# Altium schematic sheet 01_Top Level.SchDoc
size A3; SheetNumber: 1; SheetTotal: 14
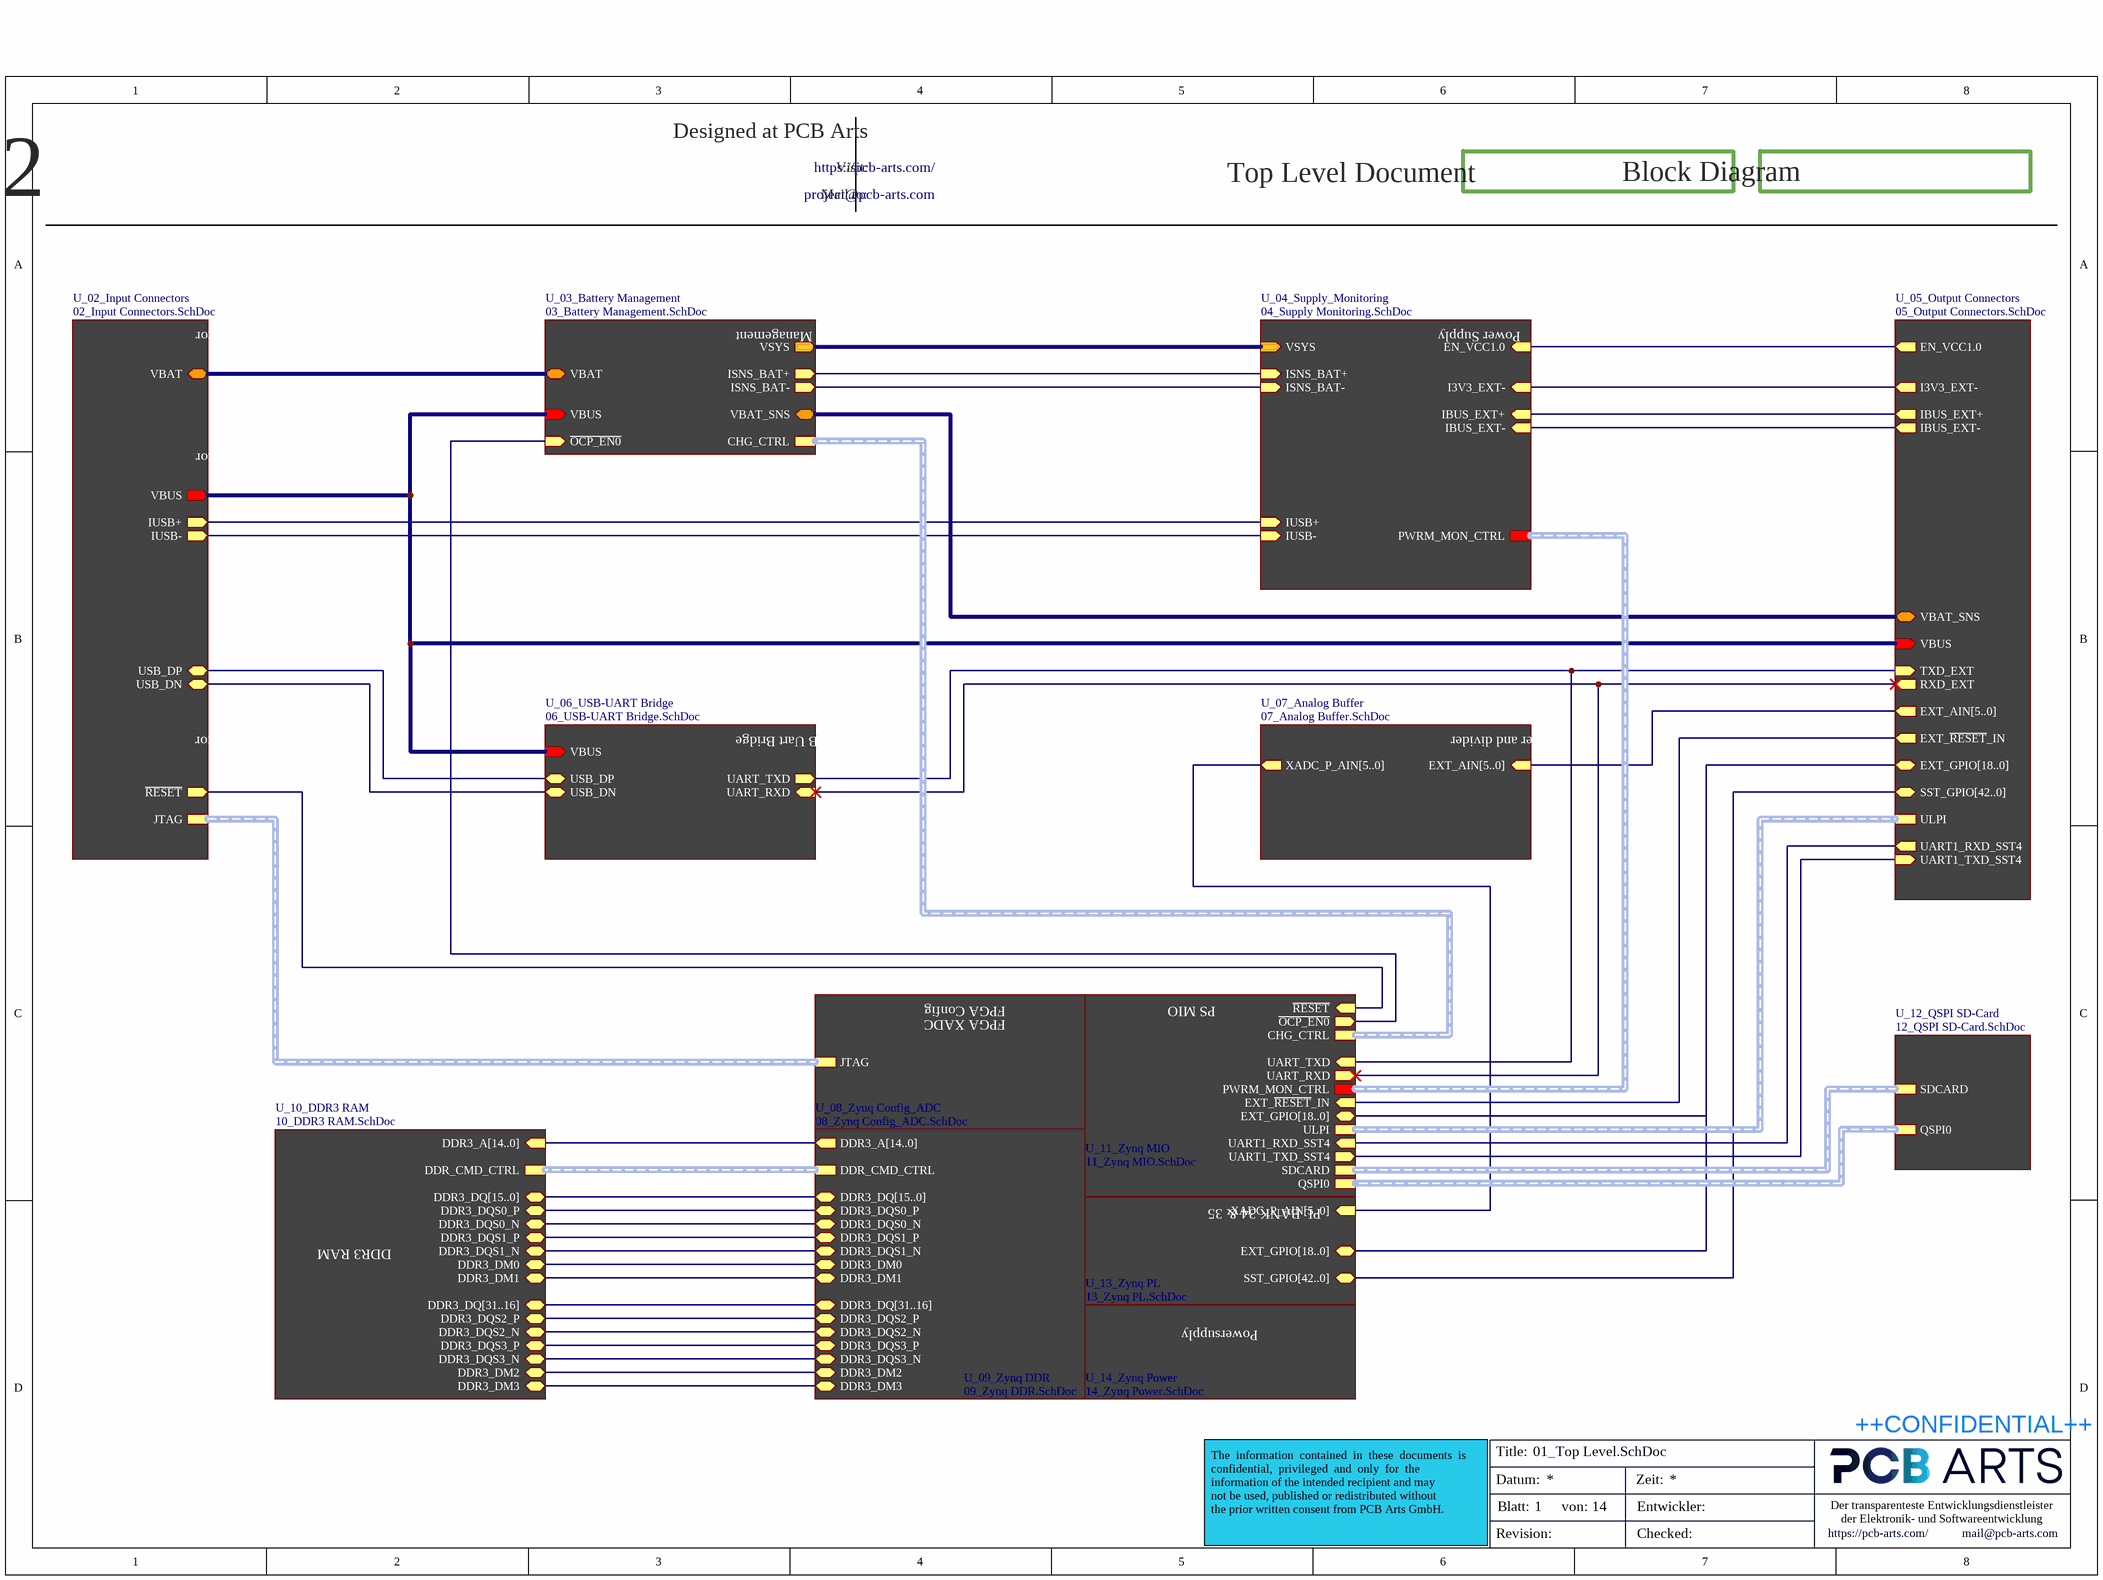
[diagram p0: 01_Top Level.SchDoc]

## Sub-sheets
U_02_Input Connectors = 02_Input Connectors.SchDoc: USB_DP (bidir), USB_DN (bidir), VBUS (out), VBAT (bidir), JTAG (harness JTAG), IUSB- (out), IUSB+ (out), ~{RESET} (out)
U_03_Battery Management = 03_Battery Management.SchDoc: VBUS (in), VBAT (bidir), VSYS (out), ISNS_BAT+ (out), ISNS_BAT- (out), VBAT_SNS (bidir), CHG_CTRL (harness CHG_CTRL), ~{OCP_EN0} (in)
U_04_Supply_Monitoring = 04_Supply Monitoring.SchDoc: EN_VCC1.0 (in), VSYS (in), PWRM_MON_CTRL (harness PWRM_MON_CTRL), ISNS_BAT+ (in), ISNS_BAT- (in), IBUS_EXT+ (in), IBUS_EXT- (in), IUSB- (in), IUSB+ (in), I3V3_EXT- (in)
U_05_Output Connectors = 05_Output Connectors.SchDoc: I3V3_EXT- (out), VBUS (in), IBUS_EXT+ (out), IBUS_EXT- (out), EN_VCC1.0 (out), VBAT_SNS (bidir), EXT_~{RESET}_IN (out), RXD_EXT (out), TXD_EXT (in), EXT_GPIO[18..0] (bidir), EXT_AIN[5..0] (out), SST_GPIO[42..0] (bidir), ULPI (harness ULPI), UART1_RXD_SST4 (out), UART1_TXD_SST4 (in)
U_06_USB-UART Bridge = 06_USB-UART Bridge.SchDoc: USB_DP (bidir), USB_DN (bidir), UART_TXD (out), UART_RXD (in), VBUS (in)
U_07_Analog Buffer = 07_Analog Buffer.SchDoc: EXT_AIN[5..0] (in), XADC_P_AIN[5..0] (out)
U_08_Zynq Config_ADC = 08_Zynq Config_ADC.SchDoc: JTAG (harness JTAG)
U_09_Zynq DDR = 09_Zynq DDR.SchDoc: DDR3_DQ[15..0] (bidir), DDR3_DQ[31..16] (bidir), DDR3_DQS0_P (bidir), DDR3_DQS0_N (bidir), DDR3_DQS1_P (bidir), DDR3_DQS1_N (bidir), DDR3_DQS2_P (bidir), DDR3_DQS2_N (bidir), DDR3_DQS3_P (bidir), DDR3_DQS3_N (bidir), DDR3_DM0 (bidir), DDR3_DM1 (bidir), DDR3_DM2 (bidir), DDR3_DM3 (bidir), DDR3_A[14..0] (out), DDR_CMD_CTRL (harness DDR_CMD_CTRL)
U_10_DDR3 RAM = 10_DDR3 RAM.SchDoc: DDR3_A[14..0] (in), DDR3_DQ[15..0] (bidir), DDR3_DQ[31..16] (bidir), DDR3_DQS0_P (bidir), DDR3_DQS0_N (bidir), DDR3_DQS1_P (bidir), DDR3_DQS1_N (bidir), DDR3_DQS2_P (bidir), DDR3_DQS2_N (bidir), DDR3_DQS3_P (bidir), DDR3_DQS3_N (bidir), DDR3_DM0 (bidir), DDR3_DM1 (bidir), DDR3_DM2 (bidir), DDR3_DM3 (bidir), DDR_CMD_CTRL (harness DDR_CMD_CTRL)
U_11_Zynq MIO = 11_Zynq MIO.SchDoc: ~{RESET} (in), UART_TXD (in), UART_RXD (out), PWRM_MON_CTRL (harness PWRM_MON_CTRL), EXT_~{RESET}_IN (in), EXT_GPIO[18..0] (bidir), SDCARD (harness SDCARD), QSPI0 (harness QSPI0), ULPI (harness ULPI), UART1_RXD_SST4 (in), UART1_TXD_SST4 (out), CHG_CTRL (harness CHG_CTRL), ~{OCP_EN0} (out)
U_12_QSPI SD-Card = 12_QSPI SD-Card.SchDoc: SDCARD (harness SDCARD), QSPI0 (harness QSPI0)
U_13_Zynq PL = 13_Zynq PL.SchDoc: EXT_GPIO[18..0] (bidir), XADC_P_AIN[5..0] (in), SST_GPIO[42..0] (bidir)
U_14_Zynq Power = 14_Zynq Power.SchDoc: no entries

## Nets
(unnamed): sheet U_02_Input Connectors/USB_DP, sheet U_06_USB-UART Bridge/USB_DP
(unnamed): sheet U_02_Input Connectors/USB_DN, sheet U_06_USB-UART Bridge/USB_DN
(unnamed): sheet U_02_Input Connectors/VBUS, sheet U_03_Battery Management/VBUS, sheet U_05_Output Connectors/VBUS, sheet U_06_USB-UART Bridge/VBUS
(unnamed): sheet U_02_Input Connectors/VBAT, sheet U_03_Battery Management/VBAT
(unnamed): sheet U_02_Input Connectors/IUSB-, sheet U_04_Supply_Monitoring/IUSB-
(unnamed): sheet U_02_Input Connectors/IUSB+, sheet U_04_Supply_Monitoring/IUSB+
(unnamed): sheet U_02_Input Connectors/~{RESET}, sheet U_11_Zynq MIO/~{RESET}
(unnamed): sheet U_03_Battery Management/VSYS, sheet U_04_Supply_Monitoring/VSYS
(unnamed): sheet U_03_Battery Management/ISNS_BAT+, sheet U_04_Supply_Monitoring/ISNS_BAT+
(unnamed): sheet U_03_Battery Management/ISNS_BAT-, sheet U_04_Supply_Monitoring/ISNS_BAT-
(unnamed): sheet U_03_Battery Management/VBAT_SNS, sheet U_05_Output Connectors/VBAT_SNS
(unnamed): sheet U_03_Battery Management/~{OCP_EN0}, sheet U_11_Zynq MIO/~{OCP_EN0}
(unnamed): sheet U_04_Supply_Monitoring/EN_VCC1.0, sheet U_05_Output Connectors/EN_VCC1.0
(unnamed): sheet U_04_Supply_Monitoring/IBUS_EXT+, sheet U_05_Output Connectors/IBUS_EXT+
(unnamed): sheet U_04_Supply_Monitoring/IBUS_EXT-, sheet U_05_Output Connectors/IBUS_EXT-
(unnamed): sheet U_04_Supply_Monitoring/I3V3_EXT-, sheet U_05_Output Connectors/I3V3_EXT-
(unnamed): sheet U_05_Output Connectors/EXT_~{RESET}_IN, sheet U_11_Zynq MIO/EXT_~{RESET}_IN
(unnamed): sheet U_05_Output Connectors/RXD_EXT, sheet U_06_USB-UART Bridge/UART_RXD, sheet U_11_Zynq MIO/UART_RXD
(unnamed): sheet U_05_Output Connectors/TXD_EXT, sheet U_06_USB-UART Bridge/UART_TXD, sheet U_11_Zynq MIO/UART_TXD
(unnamed): sheet U_05_Output Connectors/UART1_RXD_SST4, sheet U_11_Zynq MIO/UART1_RXD_SST4
(unnamed): sheet U_05_Output Connectors/UART1_TXD_SST4, sheet U_11_Zynq MIO/UART1_TXD_SST4
(unnamed): sheet U_09_Zynq DDR/DDR3_DQS0_P, sheet U_10_DDR3 RAM/DDR3_DQS0_P
(unnamed): sheet U_09_Zynq DDR/DDR3_DQS0_N, sheet U_10_DDR3 RAM/DDR3_DQS0_N
(unnamed): sheet U_09_Zynq DDR/DDR3_DQS1_P, sheet U_10_DDR3 RAM/DDR3_DQS1_P
(unnamed): sheet U_09_Zynq DDR/DDR3_DQS1_N, sheet U_10_DDR3 RAM/DDR3_DQS1_N
(unnamed): sheet U_09_Zynq DDR/DDR3_DQS2_P, sheet U_10_DDR3 RAM/DDR3_DQS2_P
(unnamed): sheet U_09_Zynq DDR/DDR3_DQS2_N, sheet U_10_DDR3 RAM/DDR3_DQS2_N
(unnamed): sheet U_09_Zynq DDR/DDR3_DQS3_P, sheet U_10_DDR3 RAM/DDR3_DQS3_P
(unnamed): sheet U_09_Zynq DDR/DDR3_DQS3_N, sheet U_10_DDR3 RAM/DDR3_DQS3_N
(unnamed): sheet U_09_Zynq DDR/DDR3_DM0, sheet U_10_DDR3 RAM/DDR3_DM0
(unnamed): sheet U_09_Zynq DDR/DDR3_DM1, sheet U_10_DDR3 RAM/DDR3_DM1
(unnamed): sheet U_09_Zynq DDR/DDR3_DM2, sheet U_10_DDR3 RAM/DDR3_DM2
(unnamed): sheet U_09_Zynq DDR/DDR3_DM3, sheet U_10_DDR3 RAM/DDR3_DM3

## Buses and harness runs
bus sheet U_05_Output Connectors/EXT_AIN[5..0] = sheet U_07_Analog Buffer/EXT_AIN[5..0]
bus sheet U_05_Output Connectors/EXT_GPIO[18..0] = sheet U_11_Zynq MIO/EXT_GPIO[18..0] = sheet U_13_Zynq PL/EXT_GPIO[18..0]
bus sheet U_05_Output Connectors/SST_GPIO[42..0] = sheet U_13_Zynq PL/SST_GPIO[42..0]
bus sheet U_07_Analog Buffer/XADC_P_AIN[5..0] = sheet U_13_Zynq PL/XADC_P_AIN[5..0]
bus sheet U_09_Zynq DDR/DDR3_A[14..0] = sheet U_10_DDR3 RAM/DDR3_A[14..0]
bus sheet U_09_Zynq DDR/DDR3_DQ[15..0] = sheet U_10_DDR3 RAM/DDR3_DQ[15..0]
bus sheet U_09_Zynq DDR/DDR3_DQ[31..16] = sheet U_10_DDR3 RAM/DDR3_DQ[31..16]
harness sheet U_02_Input Connectors/JTAG = sheet U_08_Zynq Config_ADC/JTAG
harness sheet U_03_Battery Management/CHG_CTRL = sheet U_11_Zynq MIO/CHG_CTRL
harness sheet U_04_Supply_Monitoring/PWRM_MON_CTRL = sheet U_11_Zynq MIO/PWRM_MON_CTRL
harness sheet U_05_Output Connectors/ULPI = sheet U_11_Zynq MIO/ULPI
harness sheet U_09_Zynq DDR/DDR_CMD_CTRL = sheet U_10_DDR3 RAM/DDR_CMD_CTRL
harness sheet U_11_Zynq MIO/QSPI0 = sheet U_12_QSPI SD-Card/QSPI0
harness sheet U_11_Zynq MIO/SDCARD = sheet U_12_QSPI SD-Card/SDCARD

## Notes on the sheet
- Zynq Feather Rev. 0.2
- Designed at PCB Arts
- Mail to:
- Visit:
- https://pcb-arts.com/
- project@pcb-arts.com
- Top Level Document
- Block Diagram
- Battery Connector
- Battery Management
- Power Supply
- USB-C Connector
- JTAG Connector
- USB Uart Bridge
- Buffer and divider
- FPGA Config
- FPGA XADC
- PS MIO
- DDR3 RAM
- PL BANK 34 & 35
- Powersupply
- Title:
- ++CONFIDENTIAL++
- Datum:
- Blatt:
- von:
- Zeit:
- Entwickler:
- Der transparenteste Entwicklungsdienstleister
  der Elektronik- und Softwareentwicklung
- The  information  contained  in  these  documents  is  confidential,  privileged  and  only  for  the
  information of the intended recipient and may
  not be used, published or redistributed without
  the prior written consent from PCB Arts GmbH.
- Revision:
- Checked:
- mail@pcb-arts.com